# Altium project Brd4_che.PrjPcb
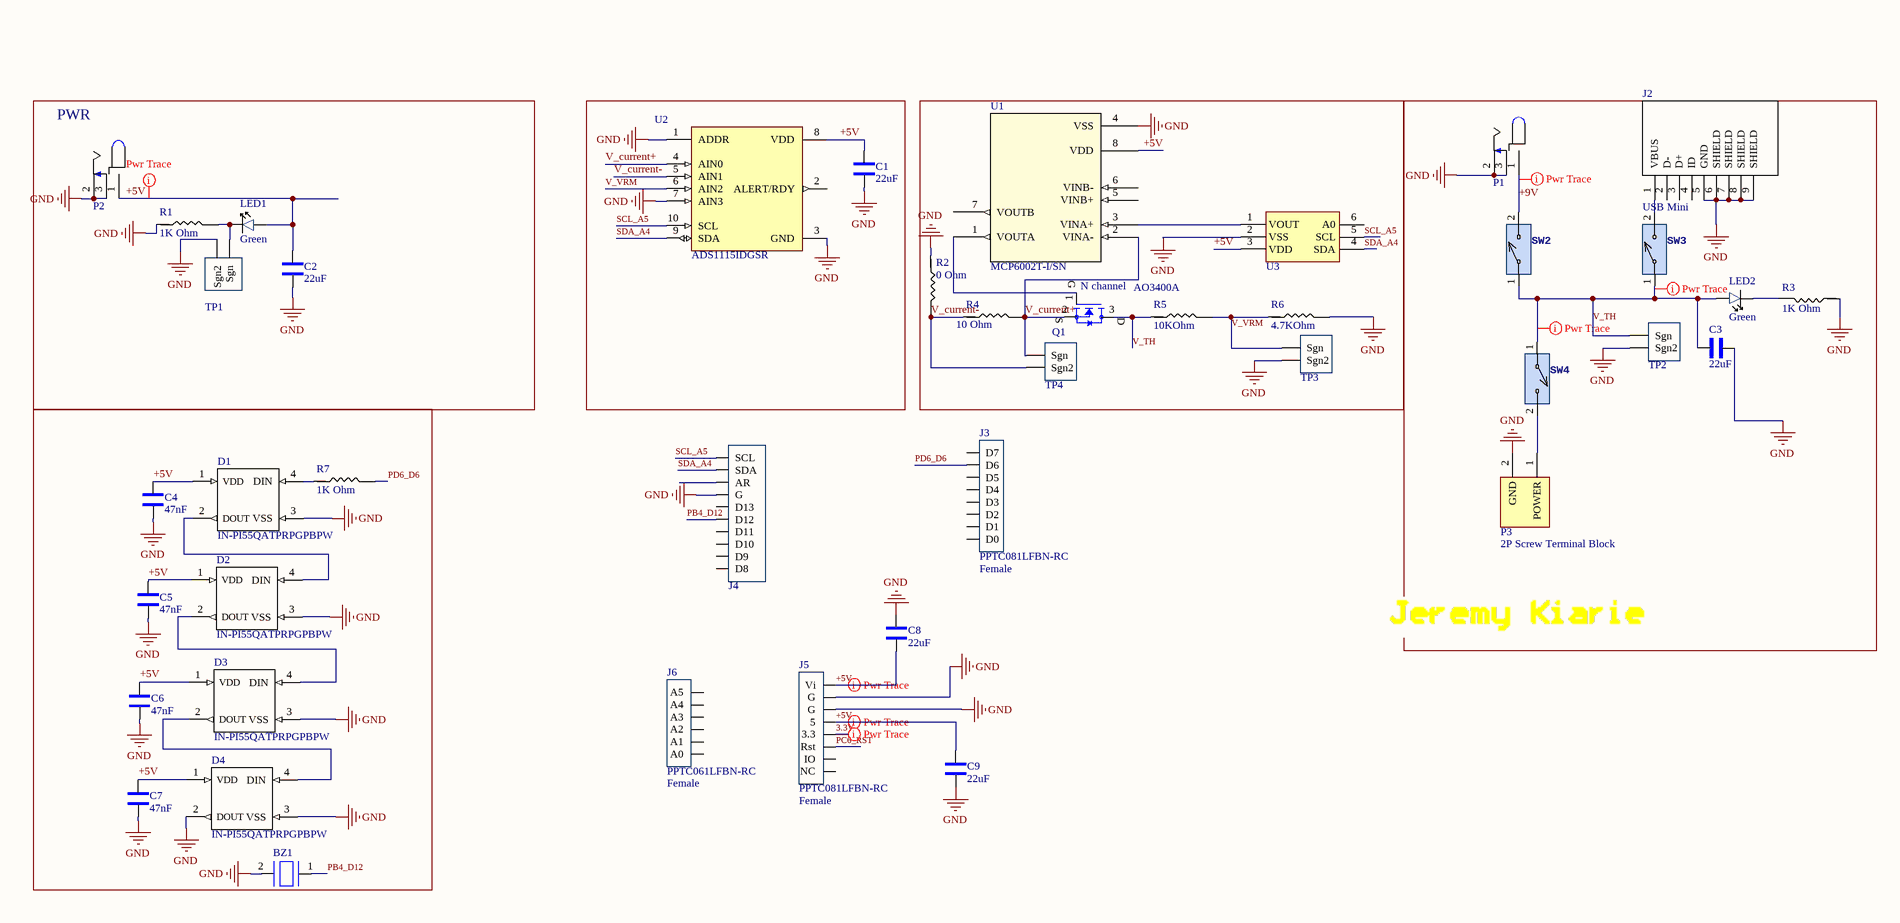
[diagram p0: Sheet1.SchDoc, left]
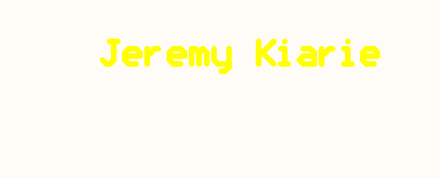
[diagram p1: Sheet1.SchDoc, right]
1 sheet, 42 parts. Net scope: global (net labels, ports and power ports of the same name join across sheets).
Board file: PCB2.PcbDoc

## Sheet Sheet1.SchDoc
size A3; SheetNumber: 1; SheetTotal: 1

### Parts
BZ1  AT-1224-TWT-5V-2-R  [BUZZER- TH]  (value not drawn)
C1  22uF  [1206_Passive_Capacitor]
C2  22uF  [1206_Passive_Capacitor]
C3  22uF  [1206_Passive_Capacitor]
C4  47nF  [1206_Passive_Capacitor]
C5  47nF  [1206_Passive_Capacitor]
C6  47nF  [1206_Passive_Capacitor]
C7  47nF  [1206_Passive_Capacitor]
C8  22uF  [1206_Passive_Capacitor]
C9  22uF  [1206_Passive_Capacitor]
D1  IN-PI55QATPRPGPBPW  [SERIAL_LED - duplicate]
D2  IN-PI55QATPRPGPBPW  [SERIAL_LED - duplicate]
D3  IN-PI55QATPRPGPBPW  [SERIAL_LED - duplicate]
D4  IN-PI55QATPRPGPBPW  [SERIAL_LED - duplicate]
J2  USB Mini  [USB_MINI_B]
J3  PPTC081LFBN-RC  value Female  [8_PIN_ARD-DIG_100MIL]
J4  PPTC101LFBN-RC  [10_PIN_ARDUINO_100MIL]  (value not drawn)
J5  PPTC081LFBN-RC  value Female  [8_PIN_ARD-PWR_100MIL]
J6  PPTC061LFBN-RC  value Female  [6_PIN_ARD-Analog_100mil]
LED1  Green  [LED_1206]
LED2  Green  [LED_1206]
P1  Power Jack  [Power_Jack]  (value not drawn)
P2  Power Jack  [Power_Jack]  (value not drawn)
P3  2P Screw Terminal Block  [P_Terminal block 3.5mm-pitch]
Q1  AO3400A  value N channel  [N-MOSFET]
R1  value 1K Ohm  [1206_Passive_Resitor]  (hidden comment: 1k)
R2  0 Ohm  [1206_Passive_Resitor]
R3  value 1K Ohm  [1206_Passive_Resitor]  (hidden comment: 1k)
R4  10 Ohm  [1206_Passive_Resitor]
R5  value 10KOhm  [1206_Passive_Resitor]  (hidden comment: 10k)
R6  4.7KOhm  [1206_Passive_Resitor]
R7  value 1K Ohm  [1206_Passive_Resitor]  (hidden comment: 1k)
SW2  SW_2Pin_100mil_Switch  [2Pin-Header-Conn]  (value not drawn)
SW3  SW_2Pin_100mil_Switch  [2Pin-Header-Conn]  (value not drawn)
SW4  SW_2Pin_100mil_Switch  [2Pin-Header-Conn]  (value not drawn)
TP1  10x Probe TP  [TP_Diff_Probe]  (value not drawn)
TP2  10x Probe TP  [TP_Diff_Probe]  (value not drawn)
TP3  10x Probe TP  [TP_Diff_Probe]  (value not drawn)
TP4  10x Probe TP  [TP_Diff_Probe]  (value not drawn)
U1  MCP6002T-I/SN  [SOIC127P600X175-8N]
U2  ADS1115IDGSR  [ADC_ADS1115IDGSR]
U3  DAC IC  [MCP4725]  (value not drawn)

### Blocks framed on the sheet
PWR: C2 LED1 P2 R1 TP1

### Nets
GND: BZ1.2(BZ2) C1.1 C2.1 C3.1 C4.1 C5.1 C6.1 C7.1 C8.2 C9.2 D1.3(VSS) D2.3(VSS) D3.3(VSS) D4.2(DOUT) D4.3(VSS) J2.5(GND) J2.6(SHIELD) J2.7(SHIELD) J2.8(SHIELD) J2.9(SHIELD) J4.4(G) J5.6(G) J5.7(G) P1.2 P1.3 P2.2 P2.3 P3.2(GND) R1.1 R2.1 R3.1 R6.2 TP1.2(Sgn2) TP2.2(Sgn2) TP3.2(Sgn2) U1.4(VSS) U2.1(ADDR) U2.3(GND) U2.7(AIN3) U3.2(VSS)
3.3V: J5.4(3.3)
+5V: C1.2 C2.2 C4.2 C5.2 C8.1 C9.1 D1.1(VDD) D2.1(VDD) J5.5 J5.8(Vi) LED1.1 P2.1 U1.8(VDD) U2.8(VDD) U3.3(VDD)
+9V: P1.1 SW2.2
PB4_D12: BZ1.1(BZ1) J4.6(D12)
PC6_RST: J5.3(Rst)
PD6_D6: J3.2(D6) R7.2
SCL_A5: J4.1(SCL) U2.10(SCL) U3.5(SCL)
SDA_A4: J4.2(SDA) U2.9(SDA) U3.4(SDA)
V_current+: Q1.2(S) R4.2 TP4.1(Sgn) U1.2(VINA-) U2.4(AIN0)
V_current-: R2.2 R4.1 TP4.2(Sgn2) U2.5(AIN1)
V_TH: C3.2 LED2.1 Q1.3(D) R5.1 SW2.1 SW3.1 SW4.1 TP2.1(Sgn)
V_VRM: R5.2 R6.1 TP3.1(Sgn) U2.6(AIN2)
NetC6_2: C6.2 D3.1(VDD)
NetC7_2: C7.2 D4.1(VDD)
NetD1_2: D1.2(DOUT) D2.4(DIN)
NetD1_4: D1.4(DIN) R7.1
NetD2_2: D2.2(DOUT) D3.4(DIN)
NetD3_2: D3.2(DOUT) D4.4(DIN)
NetJ2_1: J2.1(VBUS) SW3.2
NetLED1_2: LED1.2 R1.2 TP1.1(Sgn)
NetLED2_2: LED2.2 R3.2
NetP3_1: P3.1(POWER) SW4.2
NetQ1_1: Q1.1(G) U1.1(VOUTA)
NetU1_3: U1.3(VINA+) U3.1(VOUT)

Not connected (* = marked no-connect by the designer): J2 2(D-) 3(D+) 4(ID); J3 1(D7) 3(D5) 4(D4) 5(D3) 6(D2) 7(D1) 8(D0); J4 3(AR) 5(D13) 7(D11) 8(D10) 9(D9) 10(D8); J5 1(NC) 2(IO); J6 1(A0) 2(A1) 3(A2) 4(A3) 5(A4) 6(A5); U1 5(VINB+) 6(VINB-) 7(VOUTB); U2 2(ALERT/RDY); U3 6(A0)

### Layout directives
rule Width Constraint [Pref Width = 20mil    Min Width = 10mil    Max Width = 100mil]: 3.3V, +5V, +9V, V_TH

### Notes on the sheet
- Labels drawn without touching a wire or pin: +5V

### Library data of the parts
BZ1 = BUZZER_1: Buzzers Transducer, Externally Driven Electromechanical/Magnetic 5 V 40mA 2.4kHz 87dB @ 5V, 10cm Through Hole PC Pins; Datasheet: https://www.puiaudio.com/media/SpecSheet/AT-1224-TWT-5V-2-R.pdf
C1-C3 C8 C9 = C_22uF_1206: 22uF ±10% 25V X5R 1206 Multilayer Ceramic Capacitors MLCC - SMD/SMT RoHS; MFR Part #: CL31A226KAHNNNE; Type: basic; LCSC Part#: C12891; Datasheet: https://datasheet.lcsc.com/lcsc/1811031514_Samsung-Electro-Mechanics-CL31A226KAHNNNE_C12891.pdf; Value: 22uF
C4-C7 = C_47nF_1206: 47nF ±5% 50V C0G 1206 Multilayer Ceramic Capacitors MLCC - SMD/SMT RoHS; MFR Part #: GRM31M5C1H473JA01L; Type: Extended; LCSC Part#: C21812; Datasheet: https://datasheet.lcsc.com/lcsc/1810201313_Murata-Electronics-GRM31M5C1H473JA01L_C21812.pdf; Value: 47nF
D1-D4 = LED_Smart: LIGHT EMITTING DIODES (LED) RGB 620~630NM RED, 520~530NM GREEN, 465~475NM BLUE 600MCD@16MARED,1200MCD@16MAGREEN,300MCD@16MABLUE TOP VIEW SMD-4 ROHS; MFR Part #: XL-5050RGBC-WS2812B; Manufacturer: XINGLIGHT; LCSC Part#: C2843785; DataSheet: https://datasheet.lcsc.com/lcsc/2301111130_XINGLIGHT-XL-5050RGBC-WS2812B_C2843785.pdf
J2 = J_USB_B_Mini: Through Hole USB Connectors RoHS; MFR Part #: 920-462A2021D10102; Value: USB mini B; LCSC Part#: C46398; Datasheet: https://datasheet.lcsc.com/szlcsc/2103081233_Jing-Extension-of-the-Electronic-Co-920-462A2021D10102_C46398.pdf; Type: Extended
J3 = JF_8_PIN_FEMA_ARD-Dig: 8 Position Header Connector 0.100" (2.54mm) Through Hole Tin; Digikey Link: https://www.digikey.com/product-detail/en/PPTC081LFBN-RC/S7006-ND/810147/?itemSeq=304982354; MFR Part #: PPTC081LFBN-RC; Type: Extended; LCSC Part#: C27438
J4 = JF_10_PIN_FEMA_ARDUINO: 10 Position Header Connector 0.100" (2.54mm) Through Hole Tin; Value: Female; Digikey Link: https://www.digikey.com/product-detail/en/PPTC101LFBN-RC/S7008-ND/810149/?itemSeq=304982352; MFR Part #: PPTC101LFBN-RC; LCSC Part#: C225507; Type: Extended
J5 = JF_8_PIN_FEMA_ARD-Pwr: 8 Position Header Connector 0.100" (2.54mm) Through Hole Tin; Digikey Link: https://www.digikey.com/product-detail/en/PPTC081LFBN-RC/S7006-ND/810147/?itemSeq=304982354; MFR Part #: PPTC081LFBN-RC; Type: Extended; LCSC Part#: C27438
J6 = JF_6_PIN_FEMA_ARD-Anolog: 6 Position Header Connector 0.100" (2.54mm) Through Hole Tin; Digikey Link: https://www.digikey.com/product-detail/en/PPTC061LFBN-RC/S7004-ND/810145/?itemSeq=304982353; MFR Part #: PPTC061LFBN-RC; LCSC Part#: C40877; Type: Extended
LED1 LED2 = LED_GREEN_1206: Green 513~528nm 1206 Light Emitting Diodes (LED) RoHS; MFR Part #: SZYY1206G; Type: Extended; LCSC Part#: C434439; Datasheet: https://datasheet.lcsc.com/lcsc/2006301532_Yongyu-Photoelectric-SZYY1206G_C434439.pdf; Value: Green
P1 P2 = P_Power Jack: Power Barrel Connector Jack 2.10mm ID (0.083"), 5.50mm OD (0.217") Through Hole, Right Angle; MFR Part #: PJ-102A; Value: CONN PWR JACK 2X5.5MM SOLDER; Digikey Link: https://www.digikey.com/product-detail/en/PJ-102A/CP-102A-ND/275425/?itemSeq=304982367; LCSC Part#: C136744; Type: Extended
P3 = P_Terminal block: Green Straight pin 3.5mm  pitch; P=3.5mm  Screw terminal ROHS; MFR Part #: KF350-3.5-2P; Manufacturer: Cixi Kefa Elec; LCSC Part#: C474892; DataSheet: https://datasheet.lcsc.com/lcsc/2001160007_Cixi-Kefa-Elec-KF350-3-5-2P_C474892.pdf
Q1 = Q_Nch_MOSFET: MOSFET N Trench 30V 5.7A 1.5V @ 250uA 26.5 m? @ 5.7A,10V SOT-23-3L RoHS; Type: Basic; LCSC Part#: C20917; Datasheet: https://datasheet.lcsc.com/szlcsc/Alpha-Omega-Semicon-AOS-AO3400A_C20917.pdf; MFR Part #: AO3400A
R1 R3 R7 = R_1K_1206: CHIP RESISTOR - SURFACE MOUNT 1KOHMS ±1% 1/4W 1206 ROHS; MFR Part #: RNCP1206FTD1K00CT; Digikey Link: https://www.digikey.com/product-detail/en/RNCP1206FTD1K00/RNCP1206FTD1K00CT-ND/2240675/?itemSeq=304982373; LCSC Part#: C4410; Type: Basic
R2 = R_0Ohm_1206: CHIP RESISTOR - SURFACE MOUNT 0OHMS ±1% 1/4W 1206 ROHS; MFR Part #: 1206W4F0000T5E; Datasheet: https://datasheet.lcsc.com/szlcsc/Uniroyal-Elec-1206W4F0000T5E_C17888.pdf; LCSC Part#: C17888; Type: Basic; Mouser link: https://www.mouser.com/ProductDetail/Royalohm/1206W4F0000T5E?qs=e8oIoAS2J1Thbopin%252BsagQ%3D%3D; Value: 0 Ohm
R4 = R_10Ohm_1206: CHIP RESISTOR - SURFACE MOUNT 0.1OHMS ±1% 1/4W 1206 ROHS; MFR Part #: 1206W4F100JT5E; Datasheet: https://datasheet.lcsc.com/szlcsc/Uniroyal-Elec-1206W4F100JT5E_C17903.pdf; LCSC Part#: C17903; Type: Basic; Value: 10 Ohm
R5 = R_10KOhm_1206: 10 kOhms ±5% 0.25W, 1/4W Chip Resistor 1206 (3216 Metric) Automotive AEC-Q200 Thick Film; MFR Part #: RMCF1206FT10K0; Digikey Link: https://www.digikey.com/en/products/detail/stackpole-electronics-inc/RMCF1206FT10K0/1759669; LCSC Part#: C17902; Type: Basic
R6 = R_4.7k_1206: 4.7kΩ ±1% 0.25W ±100ppm/℃ 1206 Chip Resistor - Surface Mount RoHS; MFR Part #: 1206W4F4701T5E; LCSC Part#: C17936; Datasheet: https://datasheet.lcsc.com/lcsc/1810301414_UNI-ROYAL-Uniroyal-Elec-1206W4F4701T5E_C17936.pdf; Type: Basic; Value: 4.7KOhm
SW2-SW4 = SW_2Pin_100mil_Switch: 2Pin Header; LCSC Part#: C124375; Type: Extended
TP1-TP4 = TP_Diff_Probe: Test Point 300 mil centers
U1 = U_MCP6002T-I/SN: 0.6 V/us 2 1MHz 1.8V ~ 6V 100μA General Purpose SOIC-8_150mil  Operational Amplifier ROHS; Mfr: Microchip; MFR Part #: MCP6002T-I/SN; DataSheet: https://ww1.microchip.com/downloads/en/DeviceDoc/MCP6001-1R-1U-2-4-1-MHz-Low-Power-Op-Amp-DS20001733L.pdf; LCSC Part#: C7377; Type: Basic
U2 = U_ADC_ADS1115IDGSR: 16-Bit ADC with Integrated MUX, PGA, Comparator, Oscillator, and Reference 10-VSSOP -40 to 125; MFR Part #: ADS1115IDGSR; Package: MSOP-10 Texas Instruments; LCSC Part#: C37593; SnapEDA_Link: https://www.snapeda.com/parts/ADS1115IDGSR/Texas%20Instruments/view-part/?ref=snap; Type: Extended; DigiKey link: https://www.digikey.com/product-detail/en/texas-instruments/ADS1115IDGSR/296-38849-1-ND/5142969?utm_source=snapeda&utm_medium=aggregator&utm_campaign=symbol; Value: *
U3 = U_MCP4725A0T-E/CH: IC DAC 12BIT V-OUT SOT23-6; Datasheet: https://ww1.microchip.com/downloads/en/DeviceDoc/22039d.pdf; LCSC Part#: C144198; type: Extended; MFR Part #: MCP4725A0T-E/CH